# Altium project Eval_2_M1.PrjPcb
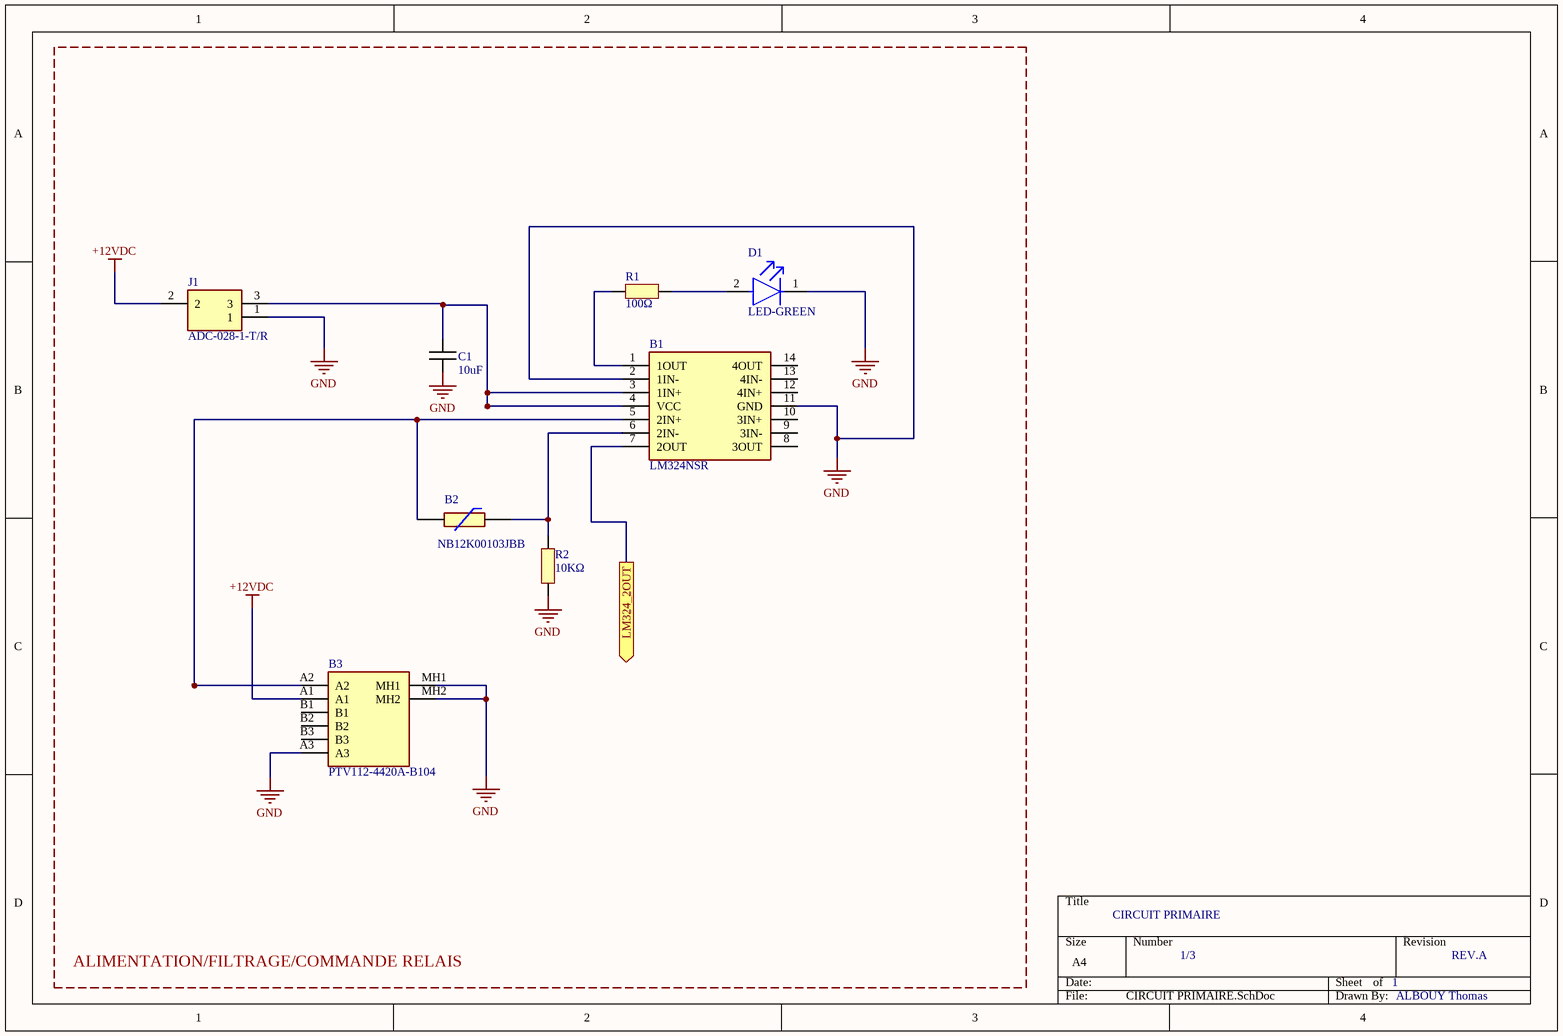
[diagram p0: CIRCUIT PRIMAIRE.SchDoc]
2 sheets, 13 parts. Net scope: flat (ports and power ports of the same name join across sheets).
Board file: PCB_Eval2_ALBOUY_Thomas.PcbDoc
Sheets:
  CIRCUIT PRIMAIRE.SchDoc
  RELAIS.SchDoc

## Sheet CIRCUIT PRIMAIRE.SchDoc: CIRCUIT PRIMAIRE
size A4; DrawnBy: ALBOUY Thomas; DocumentNumber: 1/3; Revision: REV.A; SheetNumber: 1; SheetTotal: 1

### Parts
B1  LM324NSR  [SOIC127P780X200-14N]
B2  NB12K00103JBB  [RESC2212X50N]
B3  PTV112-4420A-B104  [PTV1124420AB104]
C1  10uF  [CAPC1005X06N]
D1  LED-GREEN  [SMD-1608-LED]
J1  ADC-028-1-T/R  [PJ1021SMTTR]
R1  100Ω  [RESC1005X06N]
R2  10KΩ  [RESC1005X06N]

### Blocks framed on the sheet
ALIMENTATION/FILTRAGE/COMMANDE RELAIS: B1-B3 C1 D1 J1 R1 R2

### Ports
LM324_2OUT (out)

### Nets
+12VDC: B3.A1 J1.2
GND: B1.2(1IN-) B1.11(GND) B3.A3 B3.MH1 B3.MH2 C1.2 D1.1(C) J1.1 R2.1
NetB1_1: B1.1(1OUT) R1.1
NetB1_3: B1.3(1IN+) B1.4(VCC) C1.1 J1.3
NetB1_5: B1.5(2IN+) B2.2 B3.A2
NetB1_6: B1.6(2IN-) B2.1 R2.2
NetB1_7: B1.7(2OUT) ; port LM324_2OUT
NetD1_2: D1.2(A) R1.2

Not connected (* = marked no-connect by the designer): B1 8(3OUT) 9(3IN-) 10(3IN+) 12(4IN+) 13(4IN-) 14(4OUT); B3 B1 B2 B3

### Library data of the parts
B1 = LM324NSR: Quadruple Operational Amplifier; Manufacturer_Name: Texas Instruments; Geometry.Height: 2mm; Manufacturer_Part_Number: LM324NSR; Mouser Part Number: 595-LM324NSR; Mouser Price/Stock: https://www.mouser.co.uk/ProductDetail/Texas-Instruments/LM324NSR?qs=VBduBm9rCJQcjq4eh95DkA%3D%3D; Arrow Part Number: LM324NSR; Arrow Price/Stock: https://www.arrow.com/en/products/lm324nsr/texas-instruments?utm_currency=USD&region=nac; Datasheet Link: http://www.ti.com/lit/gpn/LM324
B2 = NB12K00103JBB: NTC SMD Thermistor, NB12K, 10K, 5% AVX 10k 0805 Protection NTC Thermistor, 5s, 2 x 1.25 x 1.3mm; Manufacturer_Name: Kyocera AVX; Geometry.Height: 0.5mm; Manufacturer_Part_Number: NB12K00103JBB; Mouser Part Number: 581-NB12K00103JBB; Mouser Price/Stock: https://www.mouser.co.uk/ProductDetail/AVX/NB12K00103JBB/?qs=4%252B6%252BTdINQeDPvI%252BQUQjJ3Q%3D%3D; Arrow Part Number: NB12K00103JBB; Arrow Price/Stock: https://www.arrow.com/en/products/nb12k00103jbb/avx; Datasheet Link: https://datasheet.datasheetarchive.com/originals/distributors/Datasheets-DGA6/551314.pdf
B3 = PTV112-4420A-B104: Potentiometers PANEL CONTROL 100kOhm; Manufacturer_Name: Bourns; Geometry.Height: 20.5mm; Manufacturer_Part_Number: PTV112-4420A-B104; Mouser Part Number: 652-PTV1124420AB104; Mouser Price/Stock: https://www.mouser.co.uk/ProductDetail/Bourns/PTV112-4420A-B104?qs=nqw9FAyaR8PT4wHHFlLdhA%3D%3D; Arrow Part Number: *; Arrow Price/Stock: *; Datasheet Link: https://www.bourns.com/docs/Product-Datasheets/PTVPTT.pdf
C1 = Capacitor
D1 = LED-GREEN: LED GREEN CLEAR CHIP SMD LTST-C190GKT; Dominant Wavelength: 569nm; Reverse Voltage: 5V; Lens Color: Colorless; Viewing Angle: 130°; Voltage: 2V; Forward Current: 30mA; Power Dissipation: 100mW; Luminous Intensity: 6mcd; Number of LEDs: 1; Forward Voltage: 2.1V; Wavelength: 565nm; Test Current: 10mA; Min Operating Temperature: -55°C; Lens Style: Clear; Mount: Surface Mount; Width: 0.8mm; Packaging: Tape and Reel; Lens Transparency: Clear; Case Code (Metric): 1608; Depth: 0.8mm; Case Code (Imperial): 0603; Case/Package: 0603; Number of Pins: 2; Max Operating Temperature: 85°C; Lead Free: Lead Free; Number of Elements: 1; Length: 1.6mm; Height: 0.8mm; Package Quantity: 1; Power Rating: 100mW; Radiation Hardening: No; Illumination Color: Green; Color: Green
J1 = ADC-028-1-T/R: Connecteurs d'alimentation continue DC POWER JACK 2MM PIN TYPE 028; Manufacturer_Name: Same Sky; Geometry.Height: 6mm; Manufacturer_Part_Number: ADC-028-1-T/R; Mouser Part Number: 737-ADC-028-1-T/R; Mouser Price/Stock: https://www.mouser.fr/ProductDetail/Adam-Tech/ADC-028-1-T-R?qs=TTVbHWoAP%2FSiqsZeR9Co0Q%3D%3D
R1 R2 = Resistor

## Sheet RELAIS.SchDoc: RELAIS
size A4; DrawnBy: ALBOUY Thomas; DocumentNumber: 2/3; Revision: REV.A; SheetNumber: 2; SheetTotal: 2
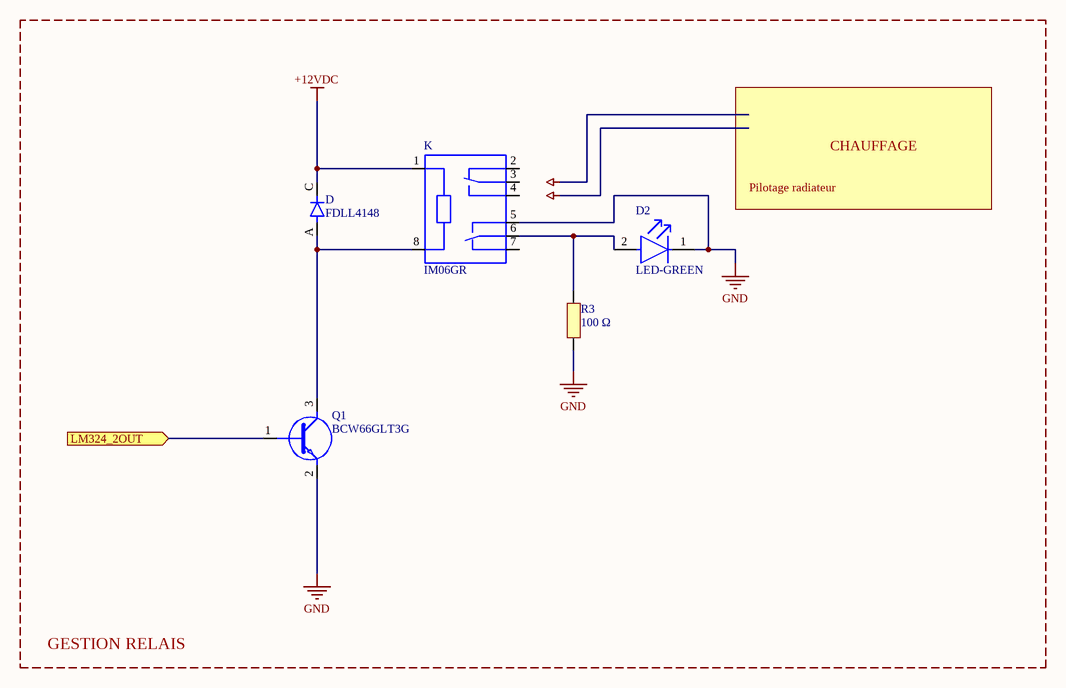
[diagram p1: RELAIS.SchDoc]

### Parts
D  FDLL4148  [DIOMELF3414N]
D2  LED-GREEN  [SMD-1608-LED]
K  IM06GR  [RELAY_IM06GR]
Q1  BCW66GLT3G  [SOT96P237X111-3N]
R3  100 Ω  [RESC1005X06N]

### Ports
LM324_2OUT (in)

### Nets
+12VDC: D.C K.1
GND: D2.1(C) K.5 Q1.2(E) R3.2
NetB1_7: Q1.1(B) ; port LM324_2OUT
NetD2_2: D2.2(A) K.6 R3.1
NetD_A: D.A K.8 Q1.3(C)

Not connected (* = marked no-connect by the designer): K 2 3 4 7

### Notes on the sheet
- CHAUFFAGE
- Pilotage radiateur
- GESTION RELAIS

### Library data of the parts
D = FDLL4148: Diode Standard 100V 200mA Surface Mount SOD-80; MF: ON Semiconductor; MP: FDLL4148; SnapEDA_Link: https://www.snapeda.com/parts/FDLL4148/ON%20Semiconductor/view-part/2783433/?ref=snap; Package: SOD-80-2 ON Semiconductor; DigiKey-Purchase-URL: https://snapeda.com/shop?store=DigiKey&id=2783433; Value: *; Mouser-Purchase-URL: https://snapeda.com/shop?store=Mouser&id=2783433; Digi-Key_Part_Number: FDLL4148CT-ND
D2 = LED-GREEN: as D1 on sheet CIRCUIT PRIMAIRE; Min Operating Temperature: -55°C; Lens Style: Clear; Mount: Surface Mount; Width: 0.8mm; Packaging: Tape and Reel; Lens Transparency: Clear; Case Code (Metric): 1608; Depth: 0.8mm; Case Code (Imperial): 0603; Case/Package: 0603; Number of Pins: 2; Max Operating Temperature: 85°C; Lead Free: Lead Free; Number of Elements: 1; Length: 1.6mm; Height: 0.8mm; Package Quantity: 1; Power Rating: 100mW; Radiation Hardening: No; Illumination Color: Green; Color: Green
K = IM06GR: Electromechanical Relay 12VDC 1.029KOhm 2A DPDT _10x7.5x5.65_mm SMD Signal Relay; MF: TE Connectivity; Package: None; Availability: Unavailable; TE_purchase_URL: https://www.te.com/usa-en/product-2-1462037-3.html?te_bu=Cor&te_type=disp&te_campaign=seda_glo_cor-seda-global-disp-prtnr-fy19-seda-model-bom-cta_sma-317_1&elqCampaignId=32493; Value: *; MP: IM06GR; SnapEDA_Link: https://www.snapeda.com/parts/IM06GR/TE%20Connectivity%20Potter%20%26%20Brumfield%20Relays/view-part/264147/?ref=snap; Price: None
Q1 = BCW66GLT3G: NPN Bipolar Transistor; Manufacturer_Name: onsemi; Geometry.Height: 1.11mm; Manufacturer_Part_Number: BCW66GLT3G; Mouser Part Number: 863-BCW66GLT3G; Mouser Price/Stock: https://www.mouser.co.uk/ProductDetail/onsemi/BCW66GLT3G?qs=XfkxeqX9xWXeTiewInI3Nw%3D%3D; Arrow Part Number: BCW66GLT3G; Arrow Price/Stock: https://www.arrow.com/en/products/bcw66glt3g/on-semiconductor?region=europe; Datasheet Link: http://www.onsemi.com/pub/Collateral/BCW66GLT1-D.PDF
R3 = Resistor

## Nets that join several sheets
+12VDC: CIRCUIT PRIMAIRE (B3.A1 J1.2), RELAIS (D.C K.1)
GND: CIRCUIT PRIMAIRE (9 pins), RELAIS (D2.1 K.5 Q1.2 R3.2)
NetB1_7: CIRCUIT PRIMAIRE (B1.7), RELAIS (Q1.1)